# Altium schematic sheet MCU.SchDoc
size A4 portrait
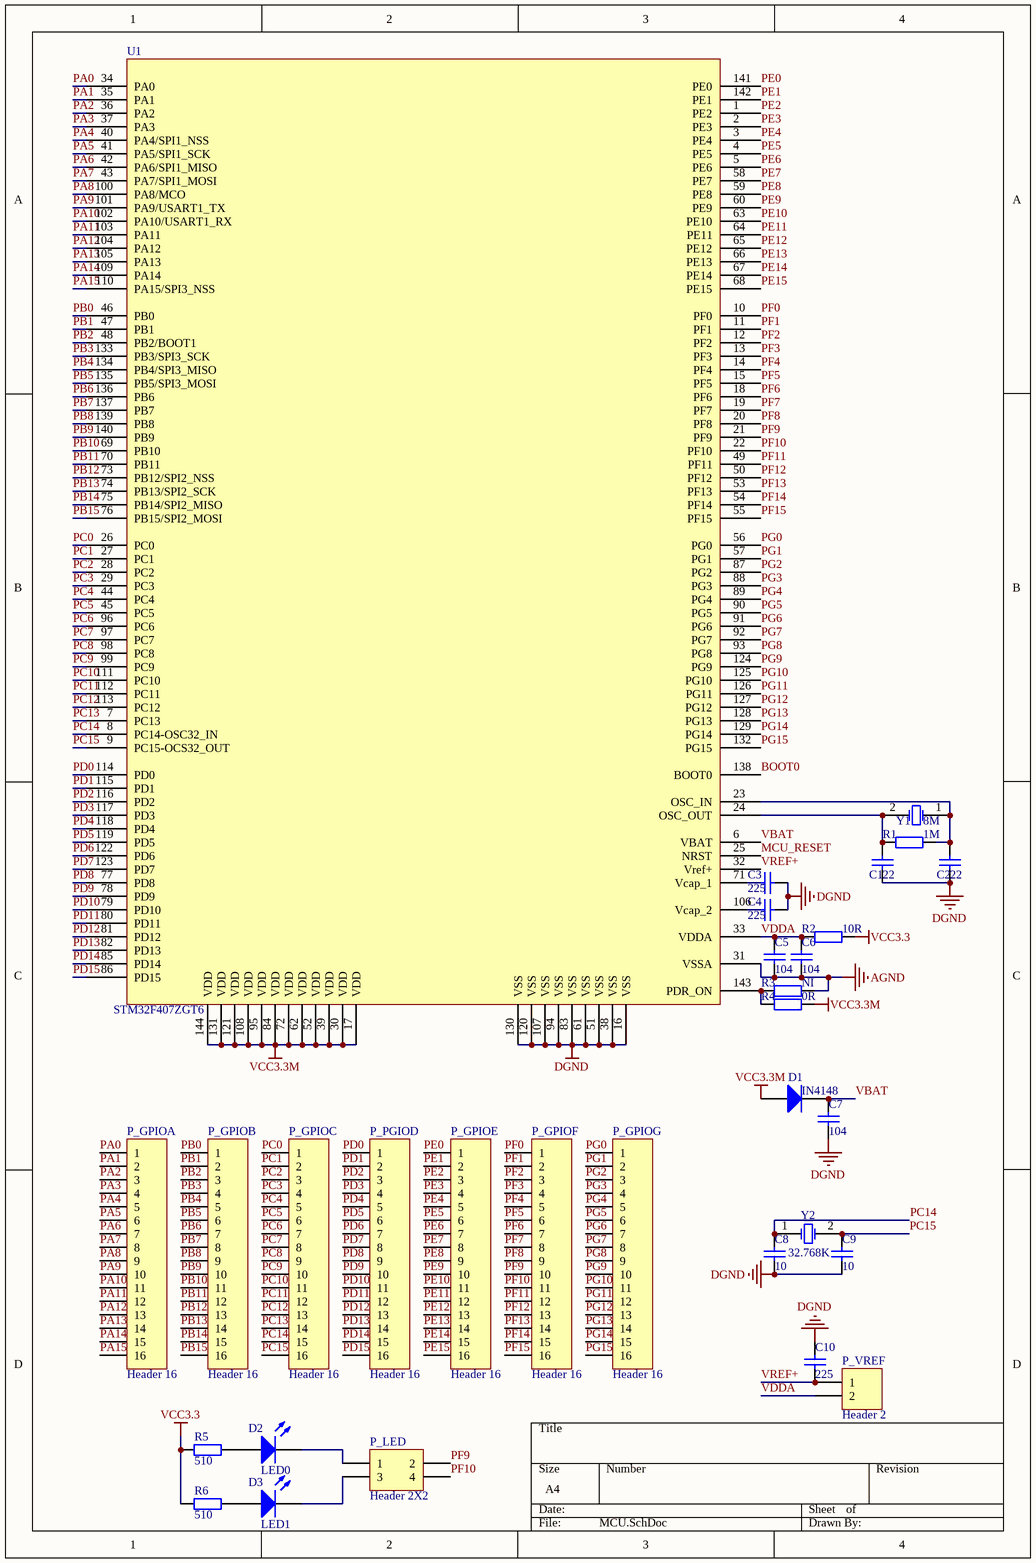
[diagram p0: MCU.SchDoc]

## Parts
C1  value 22  [SMT-0603]  (hidden comment: Cap)
C2  value 22  [SMT-0603]  (hidden comment: Cap)
C3  value 225  [SMT-0603]  (hidden comment: Cap)
C4  value 225  [SMT-0603]  (hidden comment: Cap)
C5  value 104  [SMT-0603]  (hidden comment: Cap)
C6  value 104  [SMT-0603]  (hidden comment: Cap)
C7  value 104  [SMT-0603]  (hidden comment: Cap)
C8  value 10  [SMT-0603]  (hidden comment: Cap)
C9  value 10  [SMT-0603]  (hidden comment: Cap)
C10  value 225  [SMT-0603]  (hidden comment: Cap)
D1  IN4148  [SOD-123]
D2  LED0  [K3528]
D3  LED1  [K3528]
P_GPIOA  Header 16  [HDR1X16]
P_GPIOB  Header 16  [HDR1X16]
P_GPIOC  Header 16  [HDR1X16]
P_GPIOE  Header 16  [HDR1X16]
P_GPIOF  Header 16  [HDR1X16]
P_GPIOG  Header 16  [HDR1X16]
P_LED  Header 2X2  [HDR2X2]
P_PGIOD  Header 16  [HDR1X16]
P_VREF  Header 2  [HDR1X2]
R1  value 1M  [SMT-0603]  (hidden comment: 0R)
R2  value 10R  [SMT-0603]  (hidden comment: 0R)
R3  value NI  [SMT-0603]  (hidden comment: 0R)
R4  0R  [SMT-0603]
R5  value 510  [SMT-0603]  (hidden comment: Res2)
R6  value 510  [SMT-0603]  (hidden comment: Res2)
U1  STM32F407ZGT6
Y1  8M  [D-CRYSTAL_UPRIGHT]
Y2  32.768K  [D-CRYSTAL3X8]

## Nets
AGND: C5.1 C6.1 R3.2 U1.31(VSSA)
DGND: C1.1 C2.1 C3.2 C4.2 C7.1 C8.1 C9.1 C10.2 U1.16(VSS) U1.38(VSS) U1.51(VSS) U1.61(VSS) U1.83(VSS) U1.94(VSS) U1.107(VSS) U1.120(VSS) U1.130(VSS)
VCC3.3: R2.2 R5.1 R6.1
VCC3.3M: D1.1(A) R4.2 U1.17(VDD) U1.30(VDD) U1.39(VDD) U1.52(VDD) U1.62(VDD) U1.72(VDD) U1.84(VDD) U1.95(VDD) U1.108(VDD) U1.121(VDD) U1.131(VDD) U1.144(VDD)
BOOT0: U1.138(BOOT0)
MCU_RESET: U1.25(NRST)
PA0: P_GPIOA.1 U1.34(PA0)
PA1: P_GPIOA.2 U1.35(PA1)
PA2: P_GPIOA.3 U1.36(PA2)
PA3: P_GPIOA.4 U1.37(PA3)
PA4: P_GPIOA.5 U1.40(PA4/SPI1_NSS)
PA5: P_GPIOA.6 U1.41(PA5/SPI1_SCK)
PA6: P_GPIOA.7 U1.42(PA6/SPI1_MISO)
PA7: P_GPIOA.8 U1.43(PA7/SPI1_MOSI)
PA8: P_GPIOA.9 U1.100(PA8/MCO)
PA9: P_GPIOA.10 U1.101(PA9/USART1_TX)
PA10: P_GPIOA.11 U1.102(PA10/USART1_RX)
PA11: P_GPIOA.12 U1.103(PA11)
PA12: P_GPIOA.13 U1.104(PA12)
PA13: P_GPIOA.14 U1.105(PA13)
PA14: P_GPIOA.15 U1.109(PA14)
PA15: P_GPIOA.16 U1.110(PA15/SPI3_NSS)
PB0: P_GPIOB.1 U1.46(PB0)
PB1: P_GPIOB.2 U1.47(PB1)
PB2: P_GPIOB.3 U1.48(PB2/BOOT1)
PB3: P_GPIOB.4 U1.133(PB3/SPI3_SCK)
PB4: P_GPIOB.5 U1.134(PB4/SPI3_MISO)
PB5: P_GPIOB.6 U1.135(PB5/SPI3_MOSI)
PB6: P_GPIOB.7 U1.136(PB6)
PB7: P_GPIOB.8 U1.137(PB7)
PB8: P_GPIOB.9 U1.139(PB8)
PB9: P_GPIOB.10 U1.140(PB9)
PB10: P_GPIOB.11 U1.69(PB10)
PB11: P_GPIOB.12 U1.70(PB11)
PB12: P_GPIOB.13 U1.73(PB12/SPI2_NSS)
PB13: P_GPIOB.14 U1.74(PB13/SPI2_SCK)
PB14: P_GPIOB.15 U1.75(PB14/SPI2_MISO)
PB15: P_GPIOB.16 U1.76(PB15/SPI2_MOSI)
PC0: P_GPIOC.1 U1.26(PC0)
PC1: P_GPIOC.2 U1.27(PC1)
PC2: P_GPIOC.3 U1.28(PC2)
PC3: P_GPIOC.4 U1.29(PC3)
PC4: P_GPIOC.5 U1.44(PC4)
PC5: P_GPIOC.6 U1.45(PC5)
PC6: P_GPIOC.7 U1.96(PC6)
PC7: P_GPIOC.8 U1.97(PC7)
PC8: P_GPIOC.9 U1.98(PC8)
PC9: P_GPIOC.10 U1.99(PC9)
PC10: P_GPIOC.11 U1.111(PC10)
PC11: P_GPIOC.12 U1.112(PC11)
PC12: P_GPIOC.13 U1.113(PC12)
PC13: P_GPIOC.14 U1.7(PC13)
PC14: C8.2 P_GPIOC.15 U1.8(PC14-OSC32_IN) Y2.1(OSC1)
PC15: C9.2 P_GPIOC.16 U1.9(PC15-OCS32_OUT) Y2.2(OSC2)
PD0: P_PGIOD.1 U1.114(PD0)
PD1: P_PGIOD.2 U1.115(PD1)
PD2: P_PGIOD.3 U1.116(PD2)
PD3: P_PGIOD.4 U1.117(PD3)
PD4: P_PGIOD.5 U1.118(PD4)
PD5: P_PGIOD.6 U1.119(PD5)
PD6: P_PGIOD.7 U1.122(PD6)
PD7: P_PGIOD.8 U1.123(PD7)
PD8: P_PGIOD.9 U1.77(PD8)
PD9: P_PGIOD.10 U1.78(PD9)
PD10: P_PGIOD.11 U1.79(PD10)
PD11: P_PGIOD.12 U1.80(PD11)
PD12: P_PGIOD.13 U1.81(PD12)
PD13: P_PGIOD.14 U1.82(PD13)
PD14: P_PGIOD.15 U1.85(PD14)
PD15: P_PGIOD.16 U1.86(PD15)
PE0: P_GPIOE.1 U1.141(PE0)
PE1: P_GPIOE.2 U1.142(PE1)
PE2: P_GPIOE.3 U1.1(PE2)
PE3: P_GPIOE.4 U1.2(PE3)
PE4: P_GPIOE.5 U1.3(PE4)
PE5: P_GPIOE.6 U1.4(PE5)
PE6: P_GPIOE.7 U1.5(PE6)
PE7: P_GPIOE.8 U1.58(PE7)
PE8: P_GPIOE.9 U1.59(PE8)
PE9: P_GPIOE.10 U1.60(PE9)
PE10: P_GPIOE.11 U1.63(PE10)
PE11: P_GPIOE.12 U1.64(PE11)
PE12: P_GPIOE.13 U1.65(PE12)
PE13: P_GPIOE.14 U1.66(PE13)
PE14: P_GPIOE.15 U1.67(PE14)
PE15: P_GPIOE.16 U1.68(PE15)
PF0: P_GPIOF.1 U1.10(PF0)
PF1: P_GPIOF.2 U1.11(PF1)
PF2: P_GPIOF.3 U1.12(PF2)
PF3: P_GPIOF.4 U1.13(PF3)
PF4: P_GPIOF.5 U1.14(PF4)
PF5: P_GPIOF.6 U1.15(PF5)
PF6: P_GPIOF.7 U1.18(PF6)
PF7: P_GPIOF.8 U1.19(PF7)
PF8: P_GPIOF.9 U1.20(PF8)
PF9: P_GPIOF.10 P_LED.2 U1.21(PF9)
PF10: P_GPIOF.11 P_LED.4 U1.22(PF10)
PF11: P_GPIOF.12 U1.49(PF11)
PF12: P_GPIOF.13 U1.50(PF12)
PF13: P_GPIOF.14 U1.53(PF13)
PF14: P_GPIOF.15 U1.54(PF14)
PF15: P_GPIOF.16 U1.55(PF15)
PG0: P_GPIOG.1 U1.56(PG0)
PG1: P_GPIOG.2 U1.57(PG1)
PG2: P_GPIOG.3 U1.87(PG2)
PG3: P_GPIOG.4 U1.88(PG3)
PG4: P_GPIOG.5 U1.89(PG4)
PG5: P_GPIOG.6 U1.90(PG5)
PG6: P_GPIOG.7 U1.91(PG6)
PG7: P_GPIOG.8 U1.92(PG7)
PG8: P_GPIOG.9 U1.93(PG8)
PG9: P_GPIOG.10 U1.124(PG9)
PG10: P_GPIOG.11 U1.125(PG10)
PG11: P_GPIOG.12 U1.126(PG11)
PG12: P_GPIOG.13 U1.127(PG12)
PG13: P_GPIOG.14 U1.128(PG13)
PG14: P_GPIOG.15 U1.129(PG14)
PG15: P_GPIOG.16 U1.132(PG15)
VBAT: C7.2 D1.2(K) U1.6(VBAT)
VDDA: C5.2 C6.2 P_VREF.2 R2.1 U1.33(VDDA)
VREF+: C10.1 P_VREF.1 U1.32(Vref+)
NetC1_2: C1.2 R1.1 U1.24(OSC_OUT) Y1.2(OSC2)
NetC2_2: C2.2 R1.2 U1.23(OSC_IN) Y1.1(OSC1)
NetC3_1: C3.1 U1.71(Vcap_1)
NetC4_1: C4.1 U1.106(Vcap_2)
NetD2_1: D2.1(A) R5.2
NetD2_2: D2.2(K) P_LED.1
NetD3_1: D3.1(A) R6.2
NetD3_2: D3.2(K) P_LED.3
NetR3_1: R3.1 R4.1 U1.143(PDR_ON)

## Library data of the parts
C1-C10 = Cap: Capacitor; Published: 8-Jun-2000; LatestRevisionDate: 17-Jul-2002; LatestRevisionNote: Re-released for DXP Platform.; PackageReference: RAD-0.3; Publisher: Altium Limited; PackageDescription: Radial Cap, Thru-Hole; 2 Leads; 0.3 in Pin Spacing
D1 = Diode: Default Diode; Published: 8-Jun-2000; LatestRevisionDate: 17-Jul-2002; LatestRevisionNote: Re-released for DXP Platform.; PackageVersion: Sep-1996; PackageReference: SMC; Publisher: Altium Limited; PackageDescription: DO-214-AB/SMC; 2 C-Bend Leads; Body 7.9 x 5.9 mm, inc. leads (LxW); Code_JEDEC: DO-214-AB
D2 D3 = LED0: Typical INFRARED GaAs LED; Published: 8-Jun-2000; Revision: July-2002: Re-released for DXP Platform.; Publisher: Altium Limited
P_GPIOA P_GPIOB P_GPIOC P_GPIOE P_GPIOF P_GPIOG P_PGIOD = Header 16: Header, 16-Pin; LatestRevisionDate: 17-Jul-2002; LatestRevisionNote: Re-released for DXP Platform.; Publisher: Altium Limited
P_LED = Header 2X2: Header, 2-Pin, Dual row; LatestRevisionDate: 17-Jul-2002; LatestRevisionNote: Re-released for DXP Platform.; Publisher: Altium Limited
P_VREF = Header 2: Header, 2-Pin; LatestRevisionDate: 17-Jul-2002; LatestRevisionNote: Re-released for DXP Platform.; Publisher: Altium Limited
R1-R6 = Res2: Resistor; Published: 8-Jun-2000; LatestRevisionDate: 17-Jul-2002; LatestRevisionNote: Re-released for DXP Platform.; PackageReference: AXIAL-0.4; Publisher: Altium Limited; PackageDescription: Axial Device, Thru-Hole; 2 Leads; 0.4 in Pin Spacing
  R4: Value: 0R
Y1 Y2 = XTAL: Crystal Oscillator; Published: 8-Jun-2000; LatestRevisionDate: 17-Jul-2002; LatestRevisionNote: Re-released for DXP Platform.; PackageReference: R38; Publisher: Altium Limited; PackageDescription: Crystal, Thru-Hole; 2 Leads; Body 3.1 x 8.2 mm (Dia.xH)